# Altium schematic sheet LIS3MDL.SchDoc
size A4; SheetNumber: 11; SheetTotal: 11
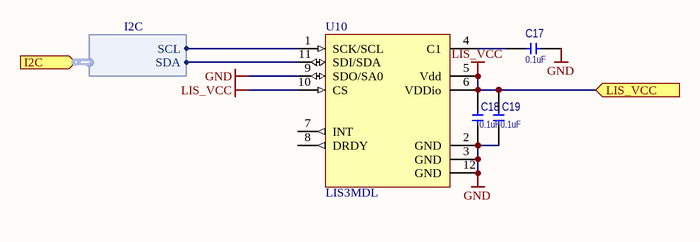
[diagram p0: LIS3MDL.SchDoc]

## Parts
C17  value 0.1uF  [CERCAP 0402]
C18  value 0.1uF  [CERCAP 0402]
C19  value 0.1uF  [CERCAP 0402]
U10  LIS3MDL  [LGA12_LIS3MDL]

## Ports
I2C (in, harness I2C), LIS_VCC (in)

## Harnesses
I2C: SCL, SDA

## Nets
GND: C17.1 C18.1 C19.1 U10.2(GND) U10.3(GND) U10.9(SDO/SA0) U10.12(GND)
LIS_VCC: C18.2 C19.2 U10.5(Vdd) U10.6(VDDio) U10.10(CS) ; port LIS_VCC
NetC17_2: C17.2 U10.4(C1)
NetU10_1: U10.1(SCK/SCL) ; port I2C.SCL
NetU10_11: U10.11(SDI/SDA) ; port I2C.SDA

Not connected (* = marked no-connect by the designer): U10 7(INT) 8(DRDY)

## Library data of the parts
C17-C19 = !Capacitor: Capacitor; IsSMT: NoSMT; Diel: X7R; Voltage: *
U10 = LIS3MDL: Mag; IsSMT: NoSMT